# EasyEDA schematic SCH_homework1_2025-05-14.json
TITLE: Sheet_1; REV: 1.0; Date: 2025-04-23; Sheet: 1/1; Drawn By: iperov.55; Company: Your Company
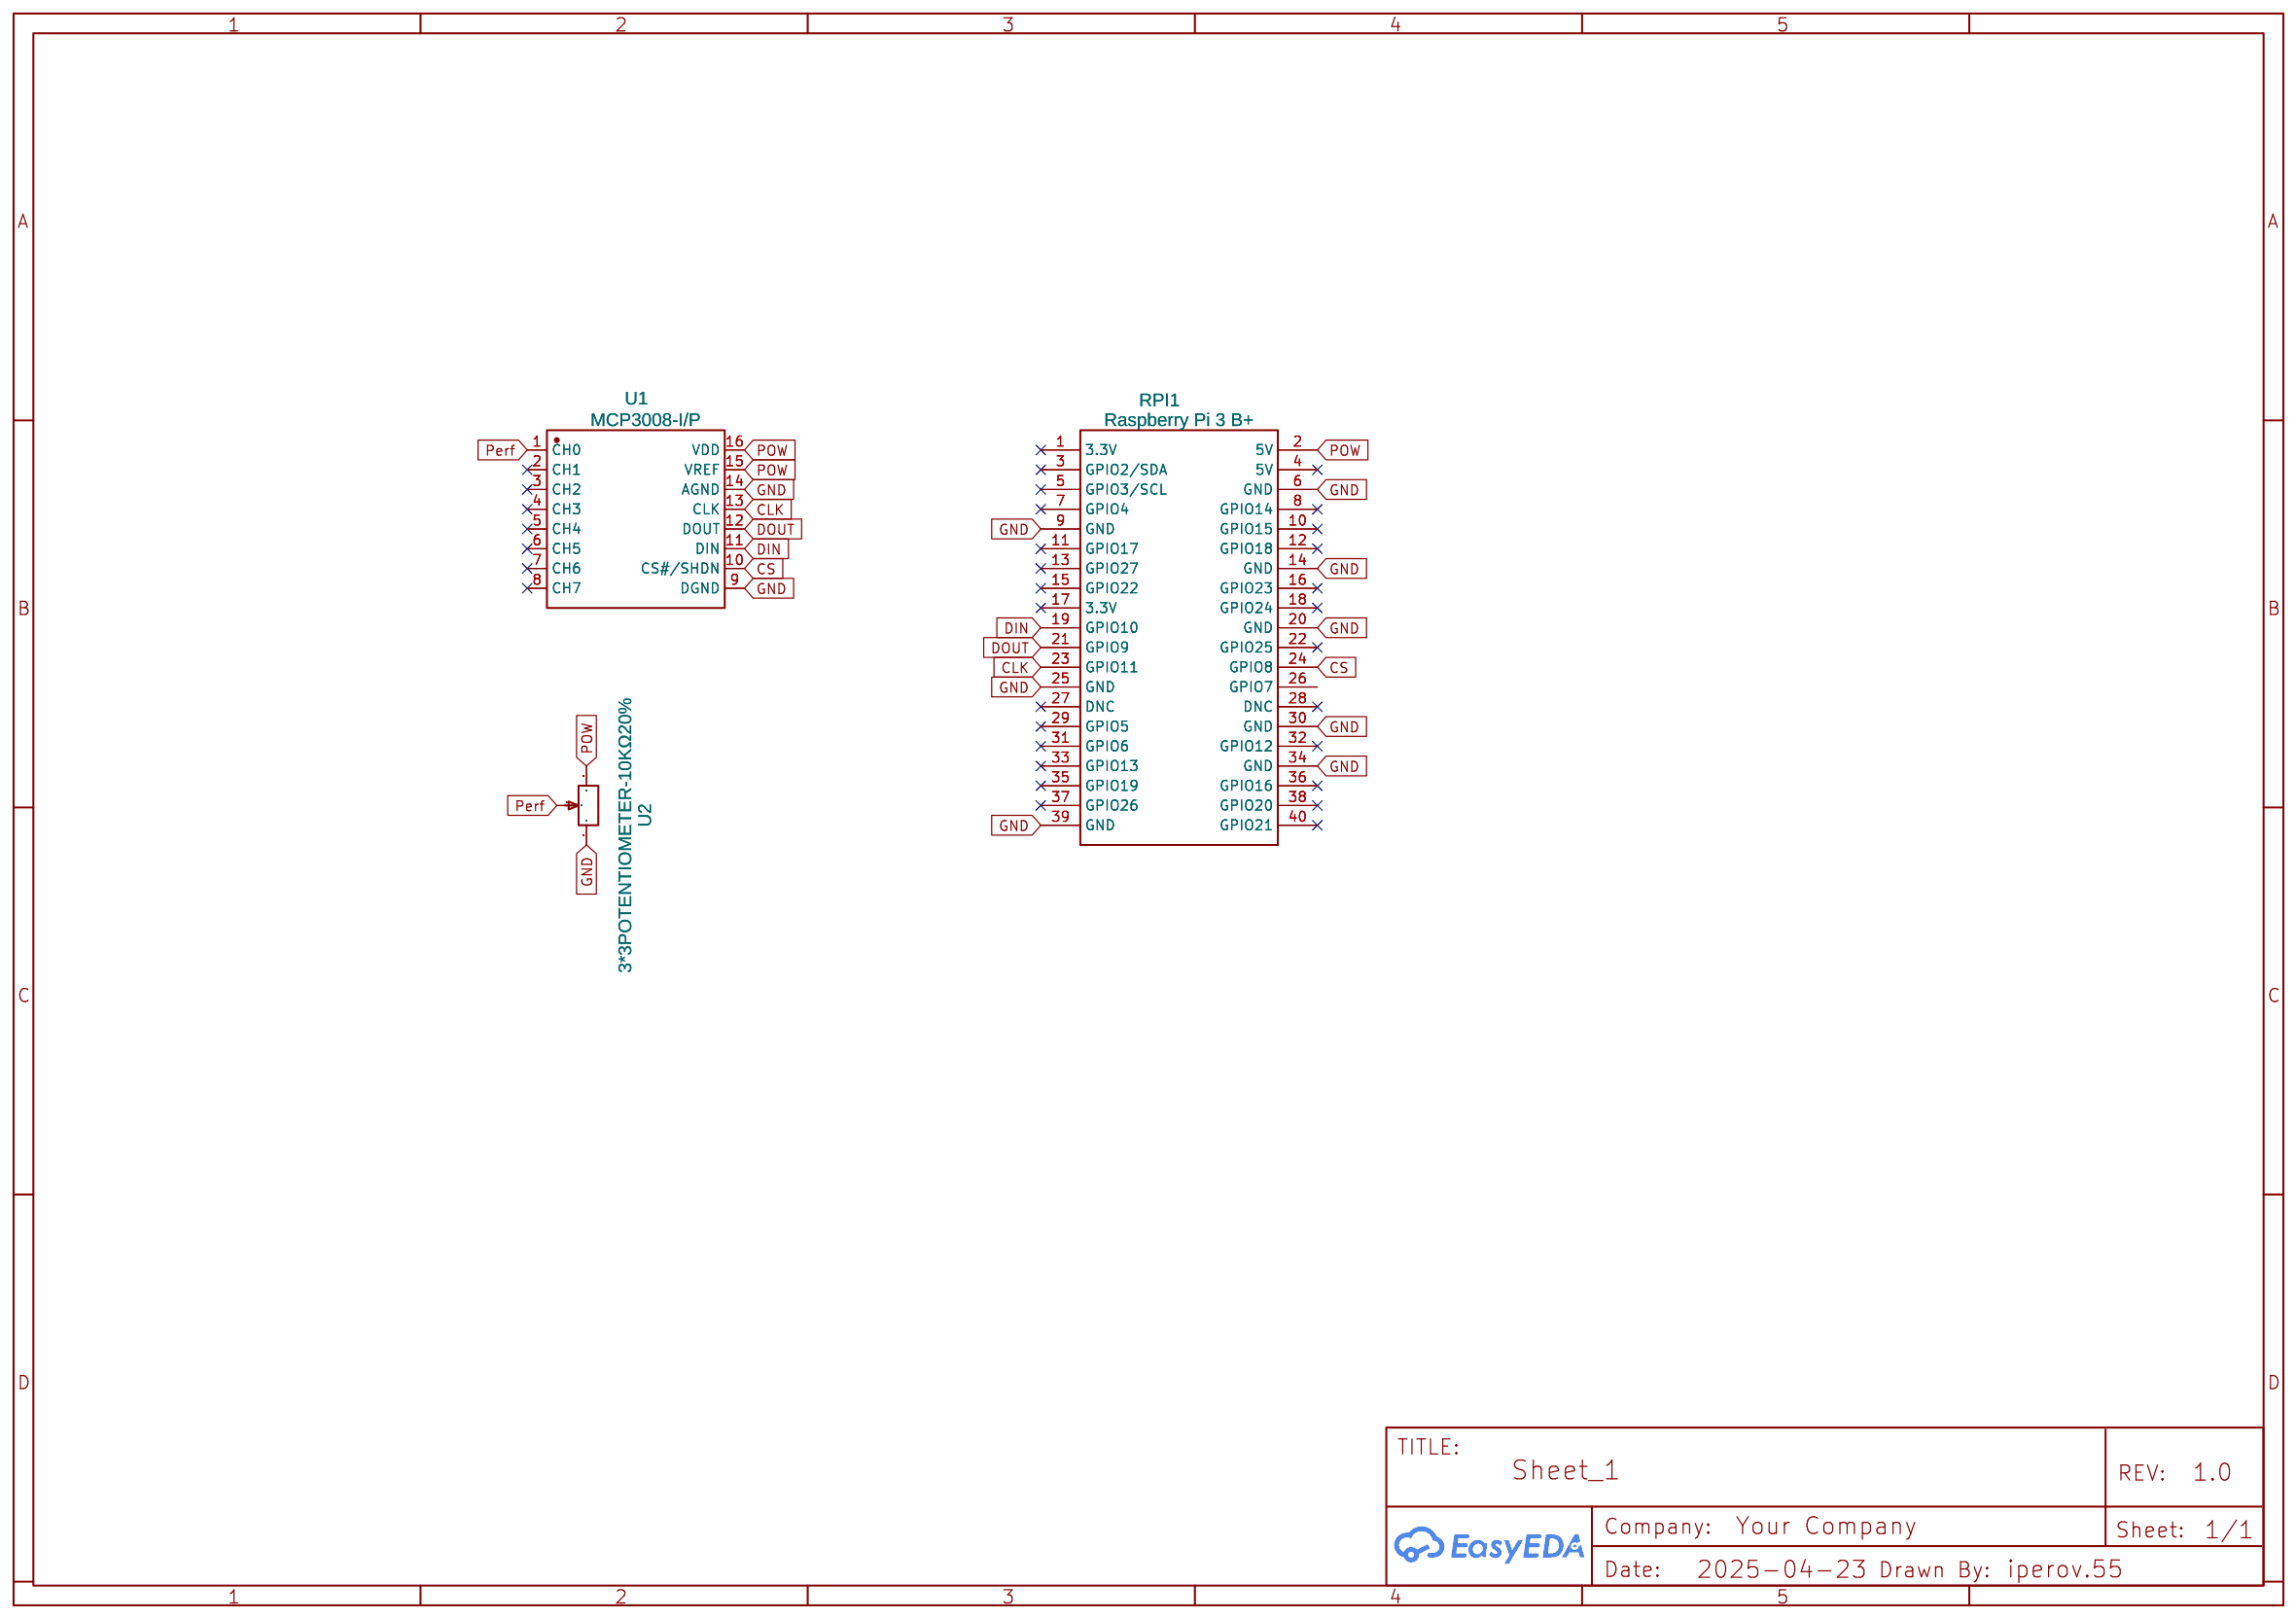
[diagram p0: schematic sheet]

## Parts
RPI1  Raspberry Pi 3 B+  [HDR-20X2/2.54]
U1  MCP3008-I/P  [PDIP-16_L19.3-W6.5-P2.54-LS7.6-BL]
U2  3*3POTENTIOMETER-10KΩ20%  [RES-ADJ-SMD_VG039NCH]

## Library data of the parts
RPI1 = Raspberry Pi 3 B+: Contributor: elielsosa23; Supplier: Adafruit; Manufacturer: Raspberry Pi; Supplier Part: 3775; Manufacturer Part: Raspberry Pi 3 - Model B+ - 1.4GHz Cortex-A53 with 1GB RAM
U1 = MCP3008-I/P: Contributor: LCSC; Supplier: LCSC; Supplier Part: C2890491; Manufacturer: MICROCHIP(美国微芯); JLCPCB Part Class: Extended Part
U2 = 3*3POTENTIOMETER-10KΩ20%: Contributor: LCSC; Supplier: LCSC; Supplier Part: C9900010776; Manufacturer: null; Manufacturer Part: 3*3Potentiometer-10kΩ20%; JLCPCB Part Class: Extended Part

## Nets
GND: RPI1.6(GND) RPI1.9(GND) RPI1.14(GND) RPI1.20(GND) RPI1.25(GND) RPI1.30(GND) RPI1.34(GND) RPI1.39(GND) U1.9(DGND) U1.14(AGND) U2.1
CLK: RPI1.23(GPIO11) U1.13(CLK)
CS: RPI1.24(GPIO8) U1.10(CS#/SHDN)
DIN: RPI1.19(GPIO10) U1.11(DIN)
DOUT: RPI1.21(GPIO9) U1.12(DOUT)
Perf: U1.1(CH0) U2.2
POW: RPI1.2(5V) U1.15(VREF) U1.16(VDD) U2.3

Not connected (* = marked no-connect by the designer): RPI1 1(3.3V)* 3(GPIO2/SDA)* 4(5V)* 5(GPIO3/SCL)* 7(GPIO4)* 8(GPIO14)* 10(GPIO15)* 11(GPIO17)* 12(GPIO18)* 13(GPIO27)* 15(GPIO22)* 16(GPIO23)* 17(3.3V)* 18(GPIO24)* 22(GPIO25)* 26(GPIO7) 27(DNC)* 28(DNC)* 29(GPIO5)* 31(GPIO6)* 32(GPIO12)* 33(GPIO13)* 35(GPIO19)* 36(GPIO16)* 37(GPIO26)* 38(GPIO20)* 40(GPIO21)*; U1 2(CH1)* 3(CH2)* 4(CH3)* 5(CH4)* 6(CH5)* 7(CH6)* 8(CH7)*
